# Altium schematic sheet bmsSlave_balancing.SchDoc
size B
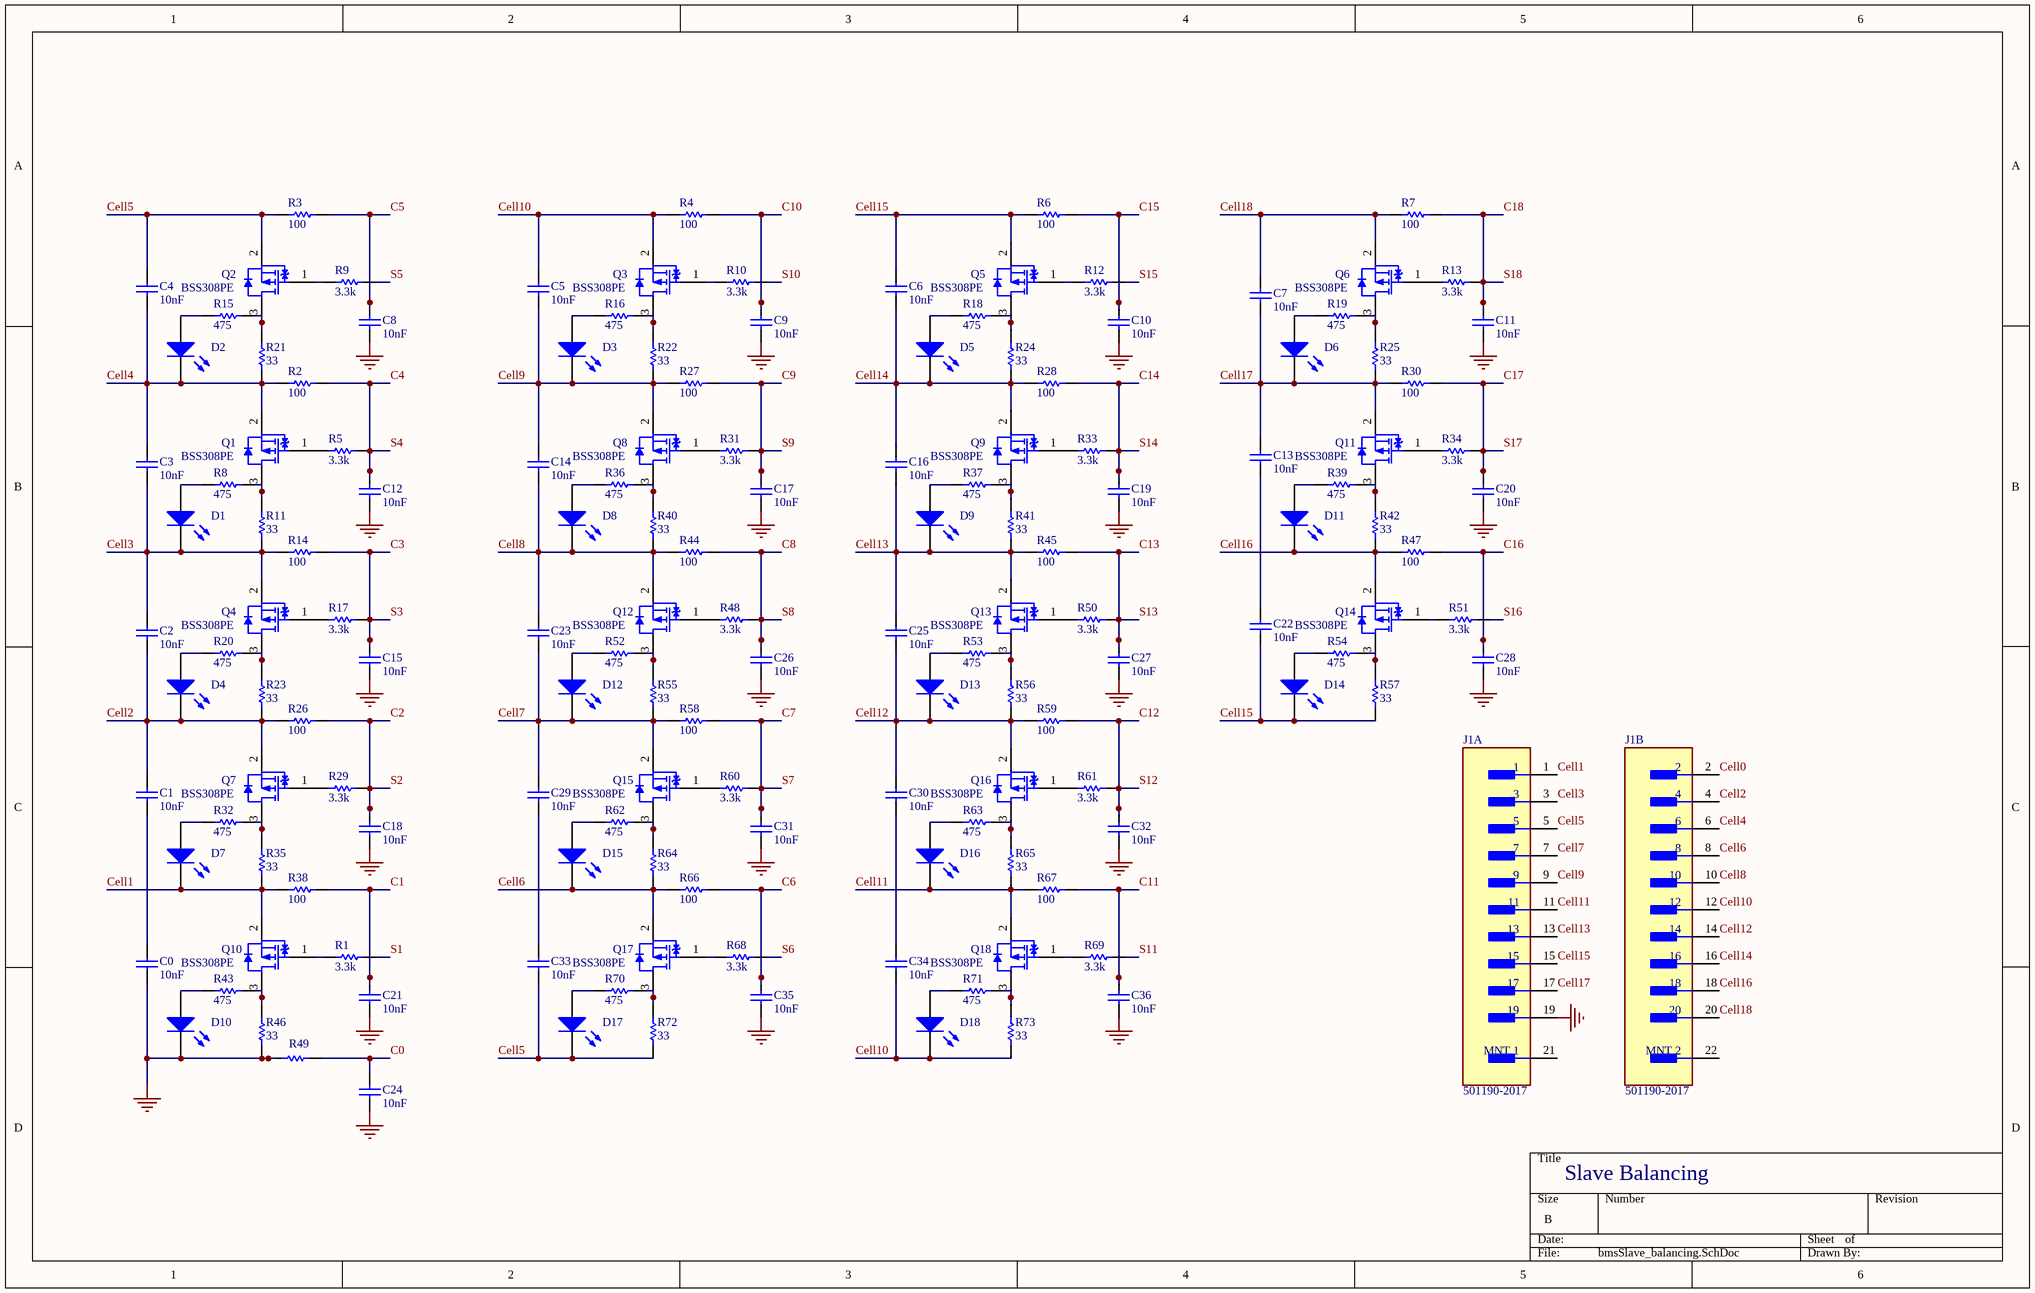
[diagram p0: bmsSlave_balancing.SchDoc]

## Parts
C0  value 10nF  (hidden comment: Capacitor)
C1  value 10nF  (hidden comment: Capacitor)
C2  value 10nF  (hidden comment: Capacitor)
C3  value 10nF  (hidden comment: Capacitor)
C4  value 10nF  (hidden comment: Capacitor)
C5  value 10nF  (hidden comment: Capacitor)
C6  value 10nF  (hidden comment: Capacitor)
C7  value 10nF  (hidden comment: Capacitor)
C8  value 10nF  (hidden comment: Capacitor)
C9  value 10nF  (hidden comment: Capacitor)
C10  value 10nF  (hidden comment: Capacitor)
C11  value 10nF  (hidden comment: Capacitor)
C12  value 10nF  (hidden comment: Capacitor)
C13  value 10nF  (hidden comment: Capacitor)
C14  value 10nF  (hidden comment: Capacitor)
C15  value 10nF  (hidden comment: Capacitor)
C16  value 10nF  (hidden comment: Capacitor)
C17  value 10nF  (hidden comment: Capacitor)
C18  value 10nF  (hidden comment: Capacitor)
C19  value 10nF  (hidden comment: Capacitor)
C20  value 10nF  (hidden comment: Capacitor)
C21  value 10nF  (hidden comment: Capacitor)
C22  value 10nF  (hidden comment: Capacitor)
C23  value 10nF  (hidden comment: Capacitor)
C24  value 10nF  (hidden comment: Capacitor)
C25  value 10nF  (hidden comment: Capacitor)
C26  value 10nF  (hidden comment: Capacitor)
C27  value 10nF  (hidden comment: Capacitor)
C28  value 10nF  (hidden comment: Capacitor)
C29  value 10nF  (hidden comment: Capacitor)
C30  value 10nF  (hidden comment: Capacitor)
C31  value 10nF  (hidden comment: Capacitor)
C32  value 10nF  (hidden comment: Capacitor)
C33  value 10nF  (hidden comment: Capacitor)
C34  value 10nF  (hidden comment: Capacitor)
C35  value 10nF  (hidden comment: Capacitor)
C36  value 10nF  (hidden comment: Capacitor)
D1  Light-Emitting Diode  (value not drawn)
D2  Light-Emitting Diode  (value not drawn)
D3  Light-Emitting Diode  (value not drawn)
D4  Light-Emitting Diode  (value not drawn)
D5  Light-Emitting Diode  (value not drawn)
D6  Light-Emitting Diode  (value not drawn)
D7  Light-Emitting Diode  (value not drawn)
D8  Light-Emitting Diode  (value not drawn)
D9  Light-Emitting Diode  (value not drawn)
D10  Light-Emitting Diode  (value not drawn)
D11  Light-Emitting Diode  (value not drawn)
D12  Light-Emitting Diode  (value not drawn)
D13  Light-Emitting Diode  (value not drawn)
D14  Light-Emitting Diode  (value not drawn)
D15  Light-Emitting Diode  (value not drawn)
D16  Light-Emitting Diode  (value not drawn)
D17  Light-Emitting Diode  (value not drawn)
D18  Light-Emitting Diode  (value not drawn)
J1  501190-2017  [FP-501190-2017-MFG]  (parts A,B of 2)
Q1  BSS308PE  [INF-PG-SOT23_L]
Q2  BSS308PE  [INF-PG-SOT23_L]
Q3  BSS308PE  [INF-PG-SOT23_L]
Q4  BSS308PE  [INF-PG-SOT23_L]
Q5  BSS308PE  [INF-PG-SOT23_L]
Q6  BSS308PE  [INF-PG-SOT23_L]
Q7  BSS308PE  [INF-PG-SOT23_L]
Q8  BSS308PE  [INF-PG-SOT23_L]
Q9  BSS308PE  [INF-PG-SOT23_L]
Q10  BSS308PE  [INF-PG-SOT23_L]
Q11  BSS308PE  [INF-PG-SOT23_L]
Q12  BSS308PE  [INF-PG-SOT23_L]
Q13  BSS308PE  [INF-PG-SOT23_L]
Q14  BSS308PE  [INF-PG-SOT23_L]
Q15  BSS308PE  [INF-PG-SOT23_L]
Q16  BSS308PE  [INF-PG-SOT23_L]
Q17  BSS308PE  [INF-PG-SOT23_L]
Q18  BSS308PE  [INF-PG-SOT23_L]
R1  value 3.3k  (hidden comment: Resistor)
R2  value 100  (hidden comment: Resistor)
R3  value 100  (hidden comment: Resistor)
R4  value 100  (hidden comment: Resistor)
R5  value 3.3k  (hidden comment: Resistor)
R6  value 100  (hidden comment: Resistor)
R7  value 100  (hidden comment: Resistor)
R8  value 475  (hidden comment: Resistor)
R9  value 3.3k  (hidden comment: Resistor)
R10  value 3.3k  (hidden comment: Resistor)
R11  value 33  (hidden comment: Resistor)
R12  value 3.3k  (hidden comment: Resistor)
R13  value 3.3k  (hidden comment: Resistor)
R14  value 100  (hidden comment: Resistor)
R15  value 475  (hidden comment: Resistor)
R16  value 475  (hidden comment: Resistor)
R17  value 3.3k  (hidden comment: Resistor)
R18  value 475  (hidden comment: Resistor)
R19  value 475  (hidden comment: Resistor)
R20  value 475  (hidden comment: Resistor)
R21  value 33  (hidden comment: Resistor)
R22  value 33  (hidden comment: Resistor)
R23  value 33  (hidden comment: Resistor)
R24  value 33  (hidden comment: Resistor)
R25  value 33  (hidden comment: Resistor)
R26  value 100  (hidden comment: Resistor)
R27  value 100  (hidden comment: Resistor)
R28  value 100  (hidden comment: Resistor)
R29  value 3.3k  (hidden comment: Resistor)
R30  value 100  (hidden comment: Resistor)
R31  value 3.3k  (hidden comment: Resistor)
R32  value 475  (hidden comment: Resistor)
R33  value 3.3k  (hidden comment: Resistor)
R34  value 3.3k  (hidden comment: Resistor)
R35  value 33  (hidden comment: Resistor)
R36  value 475  (hidden comment: Resistor)
R37  value 475  (hidden comment: Resistor)
R38  value 100  (hidden comment: Resistor)
R39  value 475  (hidden comment: Resistor)
R40  value 33  (hidden comment: Resistor)
R41  value 33  (hidden comment: Resistor)
R42  value 33  (hidden comment: Resistor)
R43  value 475  (hidden comment: Resistor)
R44  value 100  (hidden comment: Resistor)
R45  value 100  (hidden comment: Resistor)
R46  value 33  (hidden comment: Resistor)
R47  value 100  (hidden comment: Resistor)
R48  value 3.3k  (hidden comment: Resistor)
R49  Resistor  (value not drawn)
R50  value 3.3k  (hidden comment: Resistor)
R51  value 3.3k  (hidden comment: Resistor)
R52  value 475  (hidden comment: Resistor)
R53  value 475  (hidden comment: Resistor)
R54  value 475  (hidden comment: Resistor)
R55  value 33  (hidden comment: Resistor)
R56  value 33  (hidden comment: Resistor)
R57  value 33  (hidden comment: Resistor)
R58  value 100  (hidden comment: Resistor)
R59  value 100  (hidden comment: Resistor)
R60  value 3.3k  (hidden comment: Resistor)
R61  value 3.3k  (hidden comment: Resistor)
R62  value 475  (hidden comment: Resistor)
R63  value 475  (hidden comment: Resistor)
R64  value 33  (hidden comment: Resistor)
R65  value 33  (hidden comment: Resistor)
R66  value 100  (hidden comment: Resistor)
R67  value 100  (hidden comment: Resistor)
R68  value 3.3k  (hidden comment: Resistor)
R69  value 3.3k  (hidden comment: Resistor)
R70  value 475  (hidden comment: Resistor)
R71  value 475  (hidden comment: Resistor)
R72  value 33  (hidden comment: Resistor)
R73  value 33  (hidden comment: Resistor)

## Nets
NetC0_1: C0.1 C8.1 C9.1 C10.1 C11.1 C12.1 C15.1 C17.1 C18.1 C19.1 C20.1 C21.1 C24.1 C26.1 C27.1 C28.1 C31.1 C32.1 C35.1 C36.1 D10.2(K) J1.19 R46.2 R49.2
C0: C24.2 R49.1
C1: C21.2 R38.1
C2: C18.2 R26.1 R29.1  [also labelled S2]
C3: C15.2 R14.1 R17.1  [also labelled S3]
C4: C12.2 R2.1 R5.1  [also labelled S4]
C5: C8.2 R3.1
C6: C35.2 R66.1
C7: C31.2 R58.1 R60.1  [also labelled S7]
C8: C26.2 R44.1 R48.1  [also labelled S8]
C9: C17.2 R27.1 R31.1  [also labelled S9]
C10: C9.2 R4.1
C11: C36.2 R67.1
C12: C32.2 R59.1 R61.1  [also labelled S12]
C13: C27.2 R45.1 R50.1  [also labelled S13]
C14: C19.2 R28.1 R33.1  [also labelled S14]
C15: C10.2 R6.1
C16: C28.2 R47.1
C17: C20.2 R30.1 R34.1  [also labelled S17]
C18: C11.2 R7.1 R13.1  [also labelled S18]
Cell0: J1.2
Cell1: D7.2(K) J1.1 Q10.2(SOURCE) R35.2 R38.2
Cell2: C1.2 C2.1 D4.2(K) J1.4 Q7.2(SOURCE) R23.2 R26.2
Cell3: C2.2 C3.1 D1.2(K) J1.3 Q4.2(SOURCE) R11.2 R14.2
Cell4: C3.2 C4.1 D2.2(K) J1.6 Q1.2(SOURCE) R2.2 R21.2
Cell5: C4.2 C33.1 D17.2(K) J1.5 Q2.2(SOURCE) R3.2 R72.2
Cell6: D15.2(K) J1.8 Q17.2(SOURCE) R64.2 R66.2
Cell7: C23.1 C29.2 D12.2(K) J1.7 Q15.2(SOURCE) R55.2 R58.2
Cell8: C14.1 C23.2 D8.2(K) J1.10 Q12.2(SOURCE) R40.2 R44.2
Cell9: C5.1 C14.2 D3.2(K) J1.9 Q8.2(SOURCE) R22.2 R27.2
Cell10: C5.2 C34.1 D18.2(K) J1.12 Q3.2(SOURCE) R4.2 R73.2
Cell11: D16.2(K) J1.11 Q18.2(SOURCE) R65.2 R67.2
Cell12: C25.1 C30.2 D13.2(K) J1.14 Q16.2(SOURCE) R56.2 R59.2
Cell13: C16.1 C25.2 D9.2(K) J1.13 Q13.2(SOURCE) R41.2 R45.2
Cell14: C6.1 C16.2 D5.2(K) J1.16 Q9.2(SOURCE) R24.2 R28.2
Cell15: C6.2 C22.1 D14.2(K) J1.15 Q5.2(SOURCE) R6.2 R57.2
Cell16: D11.2(K) J1.18 Q14.2(SOURCE) R42.2 R47.2
Cell17: C7.1 C13.2 D6.2(K) J1.17 Q11.2(SOURCE) R25.2 R30.2
Cell18: C7.2 J1.20 Q6.2(SOURCE) R7.2
S1: R1.1
S5: R9.1
S6: R68.1
S10: R10.1
S11: R69.1
S15: R12.1
S16: R51.1
NetC0_2: C0.2 C1.1
NetC13_1: C13.1 C22.2
NetC29_1: C29.1 C33.2
NetC30_1: C30.1 C34.2
NetD1_1: D1.1(A) R8.2
NetD2_1: D2.1(A) R15.2
NetD3_1: D3.1(A) R16.2
NetD4_1: D4.1(A) R20.2
NetD5_1: D5.1(A) R18.2
NetD6_1: D6.1(A) R19.2
NetD7_1: D7.1(A) R32.2
NetD8_1: D8.1(A) R36.2
NetD9_1: D9.1(A) R37.2
NetD10_1: D10.1(A) R43.2
NetD11_1: D11.1(A) R39.2
NetD12_1: D12.1(A) R52.2
NetD13_1: D13.1(A) R53.2
NetD14_1: D14.1(A) R54.2
NetD15_1: D15.1(A) R62.2
NetD16_1: D16.1(A) R63.2
NetD17_1: D17.1(A) R70.2
NetD18_1: D18.1(A) R71.2
NetQ1_1: Q1.1(GATE) R5.2
NetQ1_3: Q1.3(DRAIN) R8.1 R11.1
NetQ2_1: Q2.1(GATE) R9.2
NetQ2_3: Q2.3(DRAIN) R15.1 R21.1
NetQ3_1: Q3.1(GATE) R10.2
NetQ3_3: Q3.3(DRAIN) R16.1 R22.1
NetQ4_1: Q4.1(GATE) R17.2
NetQ4_3: Q4.3(DRAIN) R20.1 R23.1
NetQ5_1: Q5.1(GATE) R12.2
NetQ5_3: Q5.3(DRAIN) R18.1 R24.1
NetQ6_1: Q6.1(GATE) R13.2
NetQ6_3: Q6.3(DRAIN) R19.1 R25.1
NetQ7_1: Q7.1(GATE) R29.2
NetQ7_3: Q7.3(DRAIN) R32.1 R35.1
NetQ8_1: Q8.1(GATE) R31.2
NetQ8_3: Q8.3(DRAIN) R36.1 R40.1
NetQ9_1: Q9.1(GATE) R33.2
NetQ9_3: Q9.3(DRAIN) R37.1 R41.1
NetQ10_1: Q10.1(GATE) R1.2
NetQ10_3: Q10.3(DRAIN) R43.1 R46.1
NetQ11_1: Q11.1(GATE) R34.2
NetQ11_3: Q11.3(DRAIN) R39.1 R42.1
NetQ12_1: Q12.1(GATE) R48.2
NetQ12_3: Q12.3(DRAIN) R52.1 R55.1
NetQ13_1: Q13.1(GATE) R50.2
NetQ13_3: Q13.3(DRAIN) R53.1 R56.1
NetQ14_1: Q14.1(GATE) R51.2
NetQ14_3: Q14.3(DRAIN) R54.1 R57.1
NetQ15_1: Q15.1(GATE) R60.2
NetQ15_3: Q15.3(DRAIN) R62.1 R64.1
NetQ16_1: Q16.1(GATE) R61.2
NetQ16_3: Q16.3(DRAIN) R63.1 R65.1
NetQ17_1: Q17.1(GATE) R68.2
NetQ17_3: Q17.3(DRAIN) R70.1 R72.1
NetQ18_1: Q18.1(GATE) R69.2
NetQ18_3: Q18.3(DRAIN) R71.1 R73.1

Not connected (* = marked no-connect by the designer): J1 21(MNT_1) 22(MNT_2)

## Notes on the sheet
- Slave Balancing

## Library data of the parts
C0-C36 = Capacitor: SimulationGenericComponent: True
D1-D18 = LED: AF: 1; BV: 0; BV_MAX: 1e99; EG: 1.11; FC: 0.5; IBV: 0.001; IS: 1e-14; MJSW: 0.33; NTUN: 30; TNOM: 27; XTI: 3; SimulationGenericComponent: True; CJO: 0; CJP: 0; CTA: 0; CTP: 0; FCS: 0.5; FV_MAX: 1e99; IKF: 0; IKR: 0; ISR: 1e-14; JSW: 0; JTUN: 0; JTUNSW: 0; KEG: 1; KF: 0; LEVEL: 1; N: 1; NBV: 1; NR: 1; NS: 1; PHP: 1; RS: 0; TCV: 0; TLEV: 0; TLEVC: 0; TM1: 0; TM2: 0; TPB: 0; TPHP: 0; TRS: 0; TRS2: 0; TT: 0; TTT1: 0; TTT2: 0; VJ: 1; XTITUN: 3
J1 = CMP-04776-000294-1: CONN HEADER SMD 20POS 1MM; Contact Resistance: 20mR; Number of Contacts: 20; Voltage Rating: 50V; Connector Type: Male Pin; Current Rating: 1A; Glow Wire Compliant: Non-compliant; Row Spacing: 0.105inch; Gender: Male; Termination: Solder; Housing Color: Natural; Package Quantity: 1100; Contact Type: Male Pin; Number of Circuits: 20; Min Operating Temperature: -40°C; Mount: Surface Mount; Length: 12.3mm; Pitch: 1mm; Housing Material: Thermoplastic; Depth: 7.27mm; Orientation: Vertical; Max Operating Temperature: 85°C; Lead Free: Lead Free; Voltage Rating (DC): 50V; Series: Pico-Clasp; Number of Rows: 2; Contact Material: Bronze; Contact Plating: Gold; Color: Natural; Radiation Hardening: No; Fastening Type: Latch; Packaging: Tape and Reel; Number of Positions: 20
Q1-Q18 = CMP-1099-00030-1: P-Channel OptiMOS P3 Small-Signal-Transistor, -30 V VDS, -2 A ID, -55 to 150 degC, PG-SOT23, Reel, Green; Manufacturer: Infineon; RDS (on) (max) (@4.5V): 130Â mOhm; Pto t (max): 0.5Â W; ID (max): -2Â A; IDpuls (max): -8Â A; VDS (max): -30Â V; VGS(th) (min): -2Â V; Green: TRUE; RDS (on) (max): 80Â mOhm; QG: -5Â nC; Rth: 250Â K/W; VGS(th) (max): -1Â V; PartNumber: BSS308PE; ComponentLink3Description: Package Specification; PackageDescription: 3-Pin Small Outline Transistor Package, 2.9 x 1.3 mm Body, 0.95 mm Pitch; Mounting Technology: Surface Mount; Packing: Reel; PackageReference: PG-SOT23; PackageVersion: Apr-08; Halogen-free: TRUE; DatasheetVersion: Rev. 2.03; ComponentLink2URL: http://www.infineon.com/dgdl/BSS308PE_Rev23_.pdf?folderId=db3a304314dca38901154a72e3951a65&fileId=db3a304330f686060131099c80400073; ComponentLink2Description: Datasheet; ComponentLink1Description: Manufacturer URL; ComponentLink1URL: http://www.infineon.com/; ComponentLink3URL: http://www.infineon.com/dgdl/SOT23-Package_Overview.pdf?folderId=db3a30431936bc4b0119532290053c66&fileId=db3a30431936bc4b0119533468123c85
R1-R73 = Resistor: TC1: 0; SimulationGenericComponent: True; TC2: 0